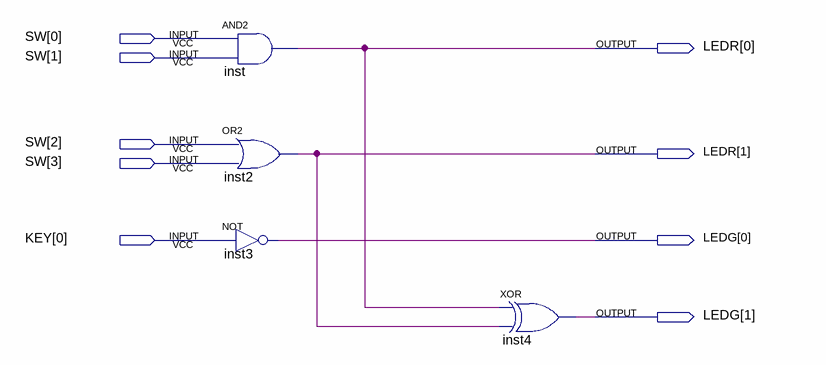
[diagram p0: schematic sheet]
// Quartus schematic Simple_Circuit.bdf as structural Verilog: 4 symbols, 9 pins
module Simple_Circuit (
  input  [3:0] SW,
  input  [0:0] KEY,
  output [1:0] LEDR,
  output [1:0] LEDG
);

  and inst (LEDR[0], SW[0], SW[1]);
  or inst2 (LEDR[1], SW[2], SW[3]);
  not inst3 (LEDG[0], KEY[0]);
  xor inst4 (LEDG[1], LEDR[0], LEDR[1]);
endmodule
